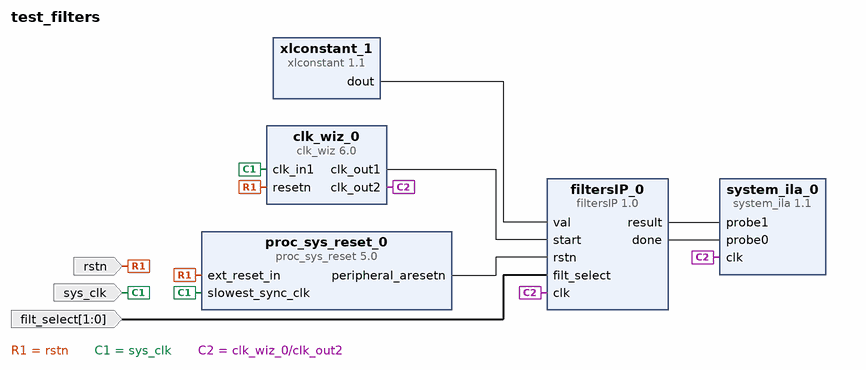
[diagram p0: block diagram of the top level]
# Vivado block design test_filters, xc7z010clg400-1, Vivado 2019.2
create_bd_design test_filters

create_bd_port -dir I -type clk sys_clk
set_property -dict {CONFIG.ASSOCIATED_RESET rstn CONFIG.FREQ_HZ 125000000} [get_bd_ports sys_clk]
create_bd_port -dir I -type rst rstn
create_bd_port -dir I -from 1 -to 0 filt_select

create_bd_cell -type ip -vlnv xilinx.com:ip:clk_wiz:6.0 clk_wiz_0
set_property -dict [list \
  CONFIG.CLKOUT1_JITTER 548.120 \
  CONFIG.CLKOUT1_PHASE_ERROR 333.440 \
  CONFIG.CLKOUT1_REQUESTED_OUT_FREQ 5 \
  CONFIG.CLKOUT2_JITTER 313.143 \
  CONFIG.CLKOUT2_PHASE_ERROR 333.440 \
  CONFIG.CLKOUT2_REQUESTED_OUT_FREQ 100 \
  CONFIG.CLKOUT2_USED true \
  CONFIG.MMCM_CLKFBOUT_MULT_F 24.125 \
  CONFIG.MMCM_CLKOUT0_DIVIDE_F 120.625 \
  CONFIG.MMCM_CLKOUT1_DIVIDE 6 \
  CONFIG.MMCM_DIVCLK_DIVIDE 5 \
  CONFIG.NUM_OUT_CLKS 2 \
  CONFIG.RESET_PORT resetn \
  CONFIG.RESET_TYPE ACTIVE_LOW \
  CONFIG.USE_LOCKED false \
  CONFIG.USE_RESET true \
] [get_bd_cells clk_wiz_0]
create_bd_cell -type ip -vlnv xilinx.com:ip:xlconstant:1.1 xlconstant_1
set_property -dict {CONFIG.CONST_VAL 1000 CONFIG.CONST_WIDTH 16} [get_bd_cells xlconstant_1]
create_bd_cell -type ip -vlnv xilinx.com:ip:system_ila:1.1 system_ila_0
set_property -dict [list \
  CONFIG.C_MON_TYPE NATIVE \
  CONFIG.C_NUM_OF_PROBES 2 \
  CONFIG.C_PROBE0_TYPE 0 \
  CONFIG.C_PROBE1_TYPE 0 \
] [get_bd_cells system_ila_0]
create_bd_cell -type ip -vlnv xilinx.com:ip:proc_sys_reset:5.0 proc_sys_reset_0
create_bd_cell -type ip -vlnv user.org:user:filtersIP:1.0 filtersIP_0

# ---- connections ----

connect_bd_net [get_bd_ports rstn] [get_bd_pins clk_wiz_0/resetn] [get_bd_pins proc_sys_reset_0/ext_reset_in]
connect_bd_net [get_bd_pins xlconstant_1/dout] [get_bd_pins filtersIP_0/val]
connect_bd_net -net result [get_bd_pins filtersIP_0/result] [get_bd_pins system_ila_0/probe1]
connect_bd_net -net done [get_bd_pins filtersIP_0/done] [get_bd_pins system_ila_0/probe0]
connect_bd_net [get_bd_pins clk_wiz_0/clk_out1] [get_bd_pins filtersIP_0/start]
connect_bd_net [get_bd_pins proc_sys_reset_0/peripheral_aresetn] [get_bd_pins filtersIP_0/rstn]
connect_bd_net -net filt_select_0_1 [get_bd_ports filt_select] [get_bd_pins filtersIP_0/filt_select]
connect_bd_net [get_bd_ports sys_clk] [get_bd_pins proc_sys_reset_0/slowest_sync_clk] [get_bd_pins clk_wiz_0/clk_in1]
connect_bd_net [get_bd_pins clk_wiz_0/clk_out2] [get_bd_pins system_ila_0/clk] [get_bd_pins filtersIP_0/clk]
set_property HDL_ATTRIBUTE.DEBUG true [get_bd_nets result]
set_property HDL_ATTRIBUTE.MARK_DEBUG true [get_bd_nets result]
set_property HDL_ATTRIBUTE.DEBUG true [get_bd_nets done]
set_property HDL_ATTRIBUTE.MARK_DEBUG true [get_bd_nets done]

validate_bd_design
save_bd_design
